# Altium schematic sheet Main.SchDoc
size A3; SheetNumber: 1
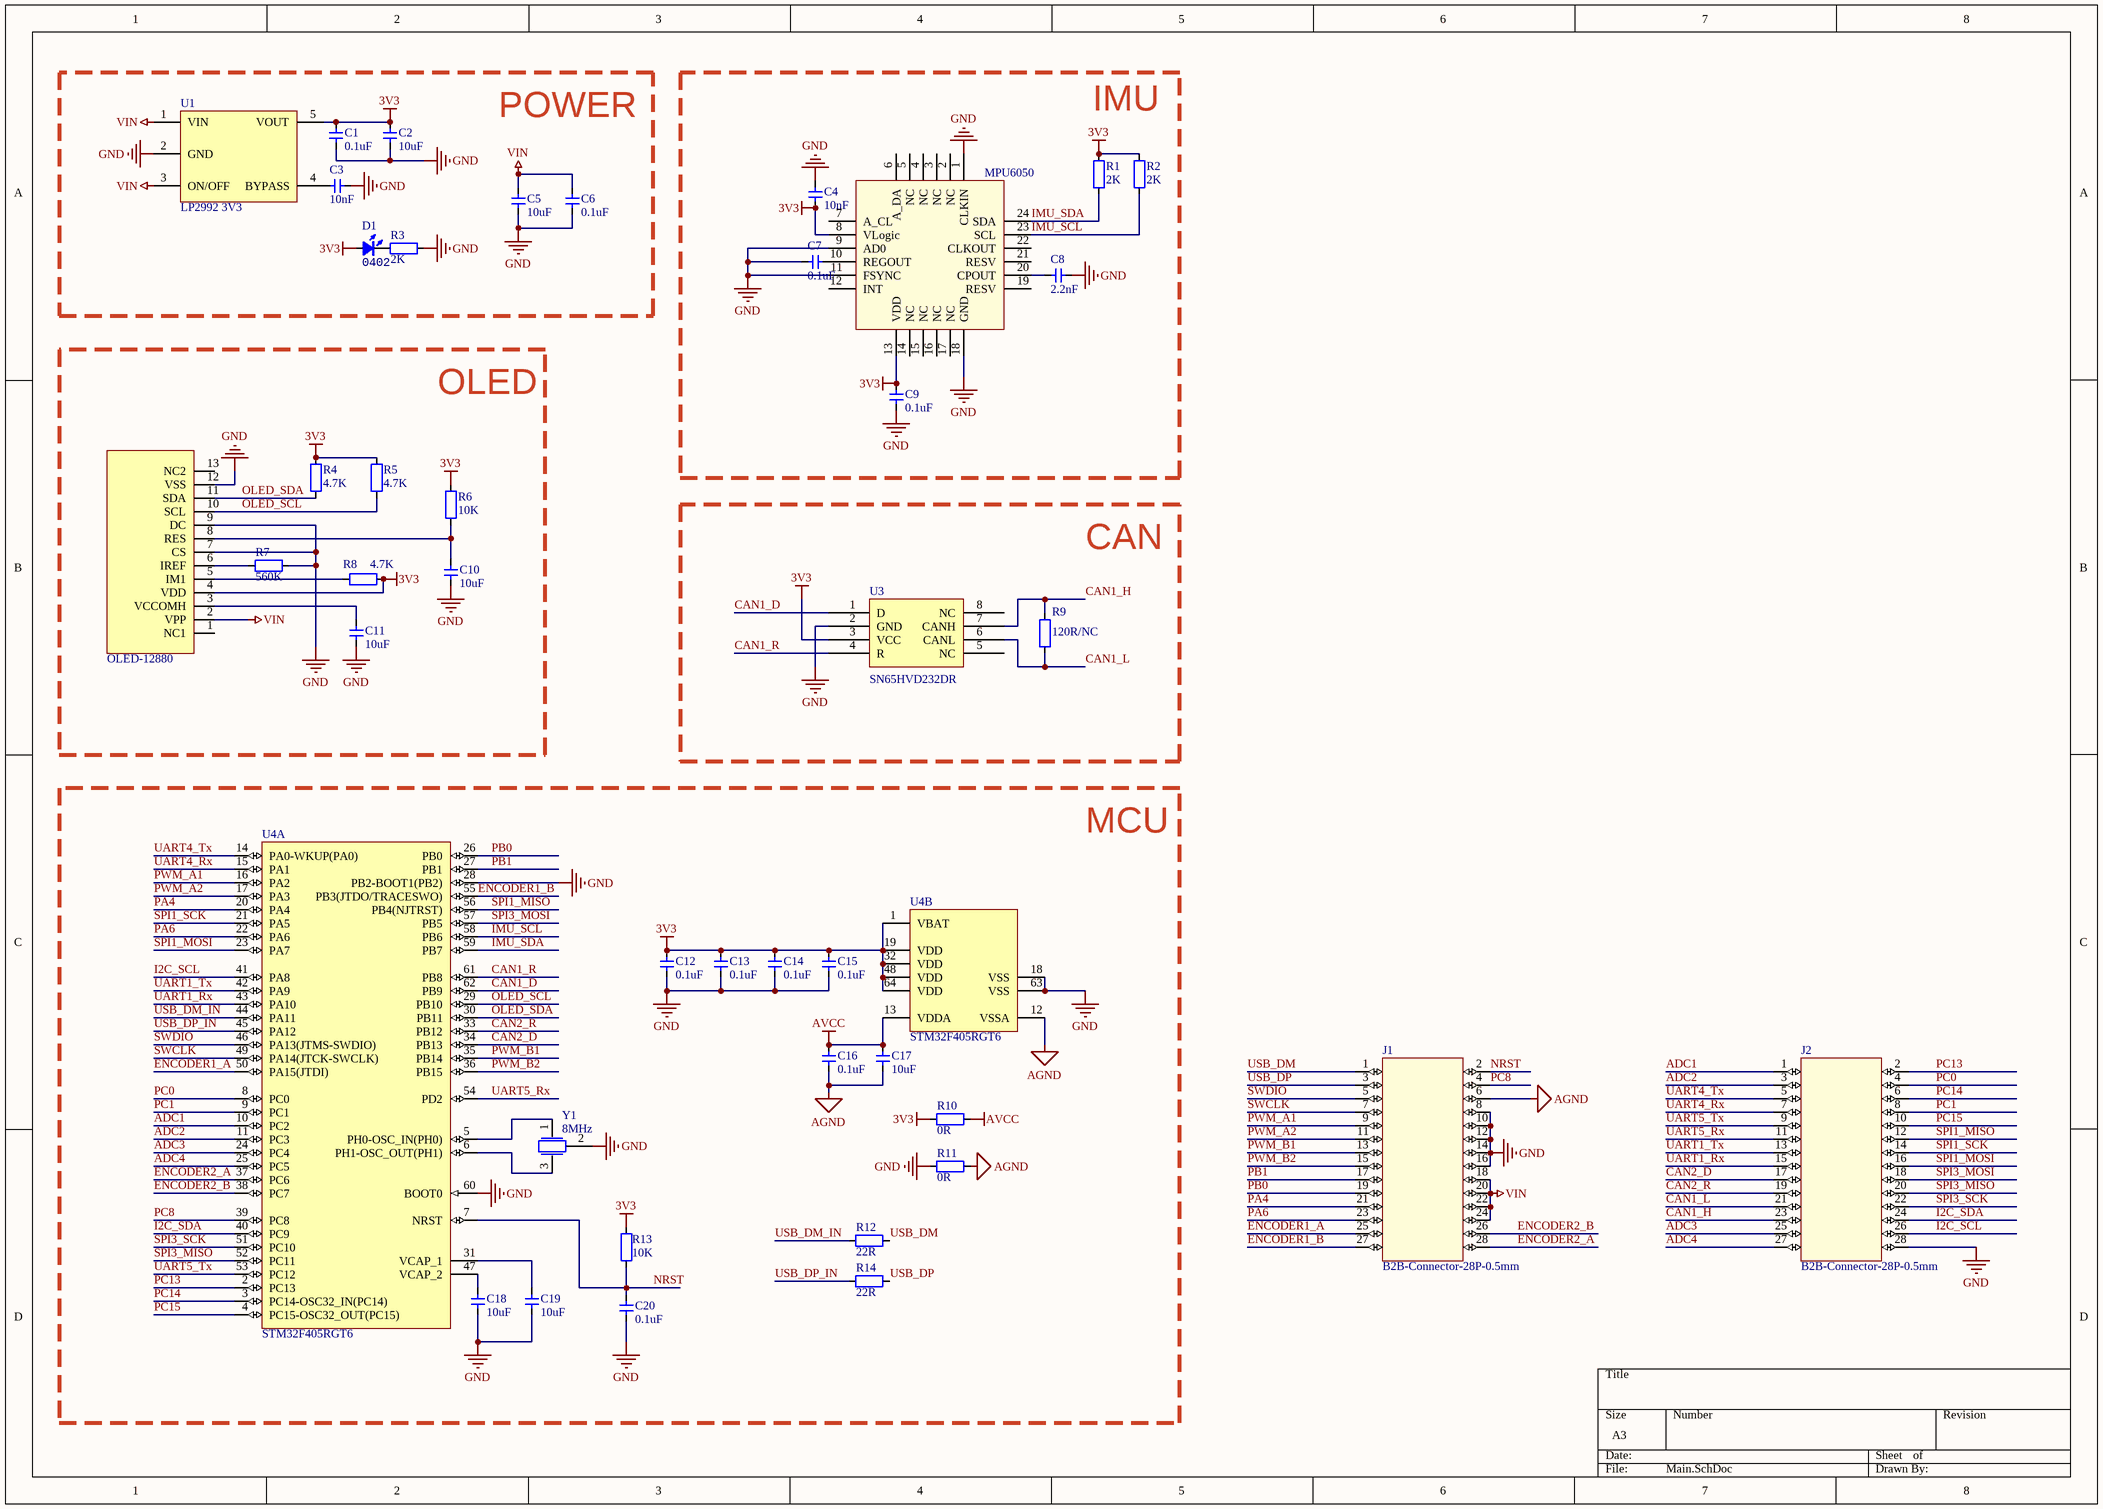
[diagram p0: Main.SchDoc]

## Parts
1  OLED-12880  [OLED-12880]
C1  0.1uF  [CAP_0402]
C2  10uF  [CAP_0402]
C3  10nF  [CAP_0402]
C4  10nF  [CAP_0402]
C5  10uF  [CAP_0402]
C6  0.1uF  [CAP_0402]
C7  0.1uF  [CAP_0402]
C8  2.2nF  [CAP_0402]
C9  0.1uF  [CAP_0402]
C10  10uF  [CAP_0402]
C11  10uF  [CAP_0402]
C12  0.1uF  [CAP_0402]
C13  0.1uF  [CAP_0402]
C14  0.1uF  [CAP_0402]
C15  0.1uF  [CAP_0402]
C16  0.1uF  [CAP_0402]
C17  10uF  [CAP_0402]
C18  10uF  [CAP_0402]
C19  10uF  [CAP_0402]
C20  0.1uF  [CAP_0402]
D1  Type: 0402  [LED_0402_RED]  (hidden comment: color?)
J1  B2B-Connector-28P-0.5mm  [B2B-0.5mm-28P-M]
J2  B2B-Connector-28P-0.5mm  [B2B-0.5mm-28P-M]
R1  2K  [RES_0402]
R2  2K  [RES_0402]
R3  2K  [RES_0402]
R4  4.7K  [RES_0402]
R5  4.7K  [RES_0402]
R6  10K  [RES_0402]
R7  560K  [RES_0402]
R8  4.7K  [RES_0402]
R9  120R/NC  [RES_0402]
R10  0R  [RES_0402]
R11  0R  [RES_0402]
R12  22R  [RES_0402]
R13  10K  [RES_0402]
R14  22R  [RES_0402]
U1  LP2992 3V3  [SOT23-5]
U2  MPU6050  [QFN-24]
U3  Manufacturer Part Number: SN65HVD232DR  [SO-8]  (hidden comment: SN65HVD232D)
U4  STM32F405RGT6  [LQFP-64_N]  (parts A,B of 2)
Y1  8MHz  [晶振-3P]

## Blocks framed on the sheet
POWER: C1-C3 C5 C6 D1 R3 U1
IMU: C4 C7-C9 R1 R2 U2
OLED: 1 C10 C11 R4-R8
CAN: R9 U3
MCU: C12-C20 R10-R14 U4 Y1

## Nets
3V3: 1.4(VDD) C1.2 C2.2 C4.1 C9.2 C12.2 C13.2 C14.2 C15.2 D1.1(A) R1.2 R2.2 R4.2 R5.2 R6.2 R8.2 R10.2 R13.2 U1.5(VOUT) U2.8(VLogic) U2.13(VDD) U3.3(VCC) U4.1(VBAT) U4.19(VDD) U4.32(VDD) U4.48(VDD) U4.64(VDD)
AGND: C16.1 C17.1 J1.6 R11.1 U4.12(VSSA)
AVCC: C16.2 C17.2 R10.1 U4.13(VDDA)
GND: 1.7(CS) 1.9(DC) 1.12(VSS) C1.1 C2.1 C3.1 C4.2 C5.1 C6.1 C7.2 C8.1 C9.1 C10.1 C11.1 C12.1 C13.1 C14.1 C15.1 C18.1 C19.1 C20.1 J1.8 J1.10 J1.12 J1.14 J1.16 J2.28 R3.1 R7.2 R11.2 U1.2(GND) U2.1(CLKIN) U2.9(AD0) U2.11(FSYNC) U2.18(GND) U3.2(GND) U4.18(VSS) U4.28(PB2-BOOT1(PB2)) U4.60(BOOT0) U4.63(VSS) Y1.2
VIN: 1.2(VPP) C5.2 C6.2 J1.18 J1.20 J1.22 J1.24 U1.1(VIN) U1.3(ON/OFF)
ADC1: J2.1 U4.10(PC2)
ADC2: J2.3 U4.11(PC3)
ADC3: J2.25 U4.24(PC4)
ADC4: J2.27 U4.25(PC5)
CAN1_D: U3.1(D) U4.62(PB9)
CAN1_H: J2.23 R9.1 U3.7(CANH)
CAN1_L: J2.21 R9.2 U3.6(CANL)
CAN1_R: U3.4(R) U4.61(PB8)
CAN2_D: J2.17 U4.34(PB13)
CAN2_R: J2.19 U4.33(PB12)
ENCODER1_A: J1.25 U4.50(PA15(JTDI))
ENCODER1_B: J1.27 U4.55(PB3(JTDO/TRACESWO))
ENCODER2_A: J1.28 U4.37(PC6)
ENCODER2_B: J1.26 U4.38(PC7)
I2C_SCL: J2.26 U4.41(PA8)
I2C_SDA: J2.24 U4.40(PC9)
IMU_SCL: R2.1 U2.23(SCL) U4.58(PB6)
IMU_SDA: R1.1 U2.24(SDA) U4.59(PB7)
NRST: C20.2 J1.2 R13.1 U4.7(NRST)
OLED_SCL: 1.10(SCL) R5.1 U4.29(PB10)
OLED_SDA: 1.11(SDA) R4.1 U4.30(PB11)
PA4: J1.21 U4.20(PA4)
PA6: J1.23 U4.22(PA6)
PB0: J1.19 U4.26(PB0)
PB1: J1.17 U4.27(PB1)
PC0: J2.4 U4.8(PC0)
PC1: J2.8 U4.9(PC1)
PC8: J1.4 U4.39(PC8)
PC13: J2.2 U4.2(PC13)
PC14: J2.6 U4.3(PC14-OSC32_IN(PC14))
PC15: J2.10 U4.4(PC15-OSC32_OUT(PC15))
PWM_A1: J1.9 U4.16(PA2)
PWM_A2: J1.11 U4.17(PA3)
PWM_B1: J1.13 U4.35(PB14)
PWM_B2: J1.15 U4.36(PB15)
SPI1_MISO: J2.12 U4.56(PB4(NJTRST))
SPI1_MOSI: J2.16 U4.23(PA7)
SPI1_SCK: J2.14 U4.21(PA5)
SPI3_MISO: J2.20 U4.52(PC11)
SPI3_MOSI: J2.18 U4.57(PB5)
SPI3_SCK: J2.22 U4.51(PC10)
SWCLK: J1.7 U4.49(PA14(JTCK-SWCLK))
SWDIO: J1.5 U4.46(PA13(JTMS-SWDIO))
UART1_Rx: J2.15 U4.43(PA10)
UART1_Tx: J2.13 U4.42(PA9)
UART4_Rx: J2.7 U4.15(PA1)
UART4_Tx: J2.5 U4.14(PA0-WKUP(PA0))
UART5_Rx: J2.11 U4.54(PD2)
UART5_Tx: J2.9 U4.53(PC12)
USB_DM: J1.1 R12.1
USB_DM_IN: R12.2 U4.44(PA11)
USB_DP: J1.3 R14.1
USB_DP_IN: R14.2 U4.45(PA12)
Net1_3: 1.3(VCCOMH) C11.2
Net1_5: 1.5(IM1) R8.1
Net1_6: 1.6(IREF) R7.1
Net1_8: 1.8(RES) C10.2 R6.1
NetC3_2: C3.2 U1.4(BYPASS)
NetC7_1: C7.1 U2.10(REGOUT)
NetC8_2: C8.2 U2.20(CPOUT)
NetC18_2: C18.2 U4.47(VCAP_2)
NetC19_2: C19.2 U4.31(VCAP_1)
NetD1_2: D1.2(K) R3.2
NetU4_5: U4.5(PH0-OSC_IN(PH0)) Y1.1
NetU4_6: U4.6(PH1-OSC_OUT(PH1)) Y1.3

Not connected (* = marked no-connect by the designer): 1 1(NC1) 13(NC2); U2 2(NC) 3(NC) 4(NC) 5(NC) 6(A_DA) 7(A_CL) 12(INT) 14(NC) 15(NC) 16(NC) 17(NC) 19(RESV) 21(RESV) 22(CLKOUT); U3 5(NC) 8(NC)

## Library data of the parts
C1-C20 = 电容-0402: Capacitor; Value: 0.1u
D1 = LED_0402: LED; Value: color?
R1-R11 R13 = 电阻-0402: Resistor; Value: 22R
R12 R14 = 电阻-0402: Resistor; Value: 22R
U1 = LP2992: LDO
U2 = MPU6050: 六轴传感器
U3 = SN65HVD232D: Manufacturer: Texas Instruments; Protocol: CAN; Number of Drivers/Receivers: 1/1; Duplex: Half; Data Rate: 1Mbps; Voltage - Supply: 3 V ~ 3.6 V; Supplier 1: Digi-Key; Supplier Part Number 1: 296-26344-2-ND; RoHS: RoHS Compliant; Category: Integrated Circuits (ICs); Stock: 5000; Pricing 1: 2500=0.84375 (USD); Packaging: Tape & Reel (TR); Part Status: Active; Type: Transceiver; Operating Temperature: -40°C ~ 85°C; Mounting Type: Surface Mount; Package / Case: 8-SOIC (0.154", 3.90mm Width); Supplier Device Package: 8-SOIC; ComponentLink1URL: http://www.ti.com/lit/ds/symlink/sn65hvd230.pdf; ComponentLink1Description: http://www.ti.com/lit/ds/symlink/sn65hvd230.pdf; Supplier 2: Digi-Key; Supplier Part Number 2: 296-26344-1-ND; Pricing 2: 1=2.05, 10=1.842, 100=1.4809, 500=1.21668, 1000=1.00811 (USD)
U4 = STM32F405RGT6: ARM Cortex-M4 32-bit MCU+FPU, 210 DMIPS, 1024 kB Flash, 192 kB Internal RAM, 51 I/Os, 64-pin LQFP, -40 to 85 degC, Tray; Manufacturer: STMicroelectronics; D/A Converter: 2x12-bit; FLASH Size (Prog) (kB): 1024; I/Os (High Current): 51; Internal RAM Size (kB): 192; Operating Frequency(F) (Processor speed) (MHz): 168; Supply Voltage(Vcc) max (V): 3.6; Supply Voltage(Vcc) min (V): 1.8; DatasheetVersion: Rev. 4; PackageVersion: Rev. 4, 06/2013; PackageReference: LQFP64; PackageDescription: 64-Pin Low Profile Quad Flat Package, 10 x 10 mm Body, 0.5 mm Pitch; Supplier 1: Digi-Key; Supplier Part Number 1: 497-11767-ND; Supplier 2: Farnell; Supplier Part Number 2: 2064363; Supplier 3: Newark; Supplier Part Number 3: 73T2329; Supplier 4: Mouser; Supplier Part Number 4: 511-STM32F405RGT6; Core: ARM Cortex-M4; Packing: Tray; Mounting Technology: Surface Mount; PartNumber: STM32F405RGT6; ComponentLink1Description: Manufacturer URL; ComponentLink1URL: http://www.st.com/web/en/home.html; ComponentLink2Description: Datasheet; ComponentLink2URL: http://www.st.com/st-web-ui/static/active/en/resource/technical/document/datasheet/DM00037051.pdf; ComponentLink3Description: Package Specification; ComponentLink3URL: http://www.st.com/st-web-ui/static/active/en/resource/technical/document/datasheet/DM00037051.pdf
Y1 = 晶振-3Pin: 村田贴片